# Altium schematic sheet STM32.SchDoc
size A3
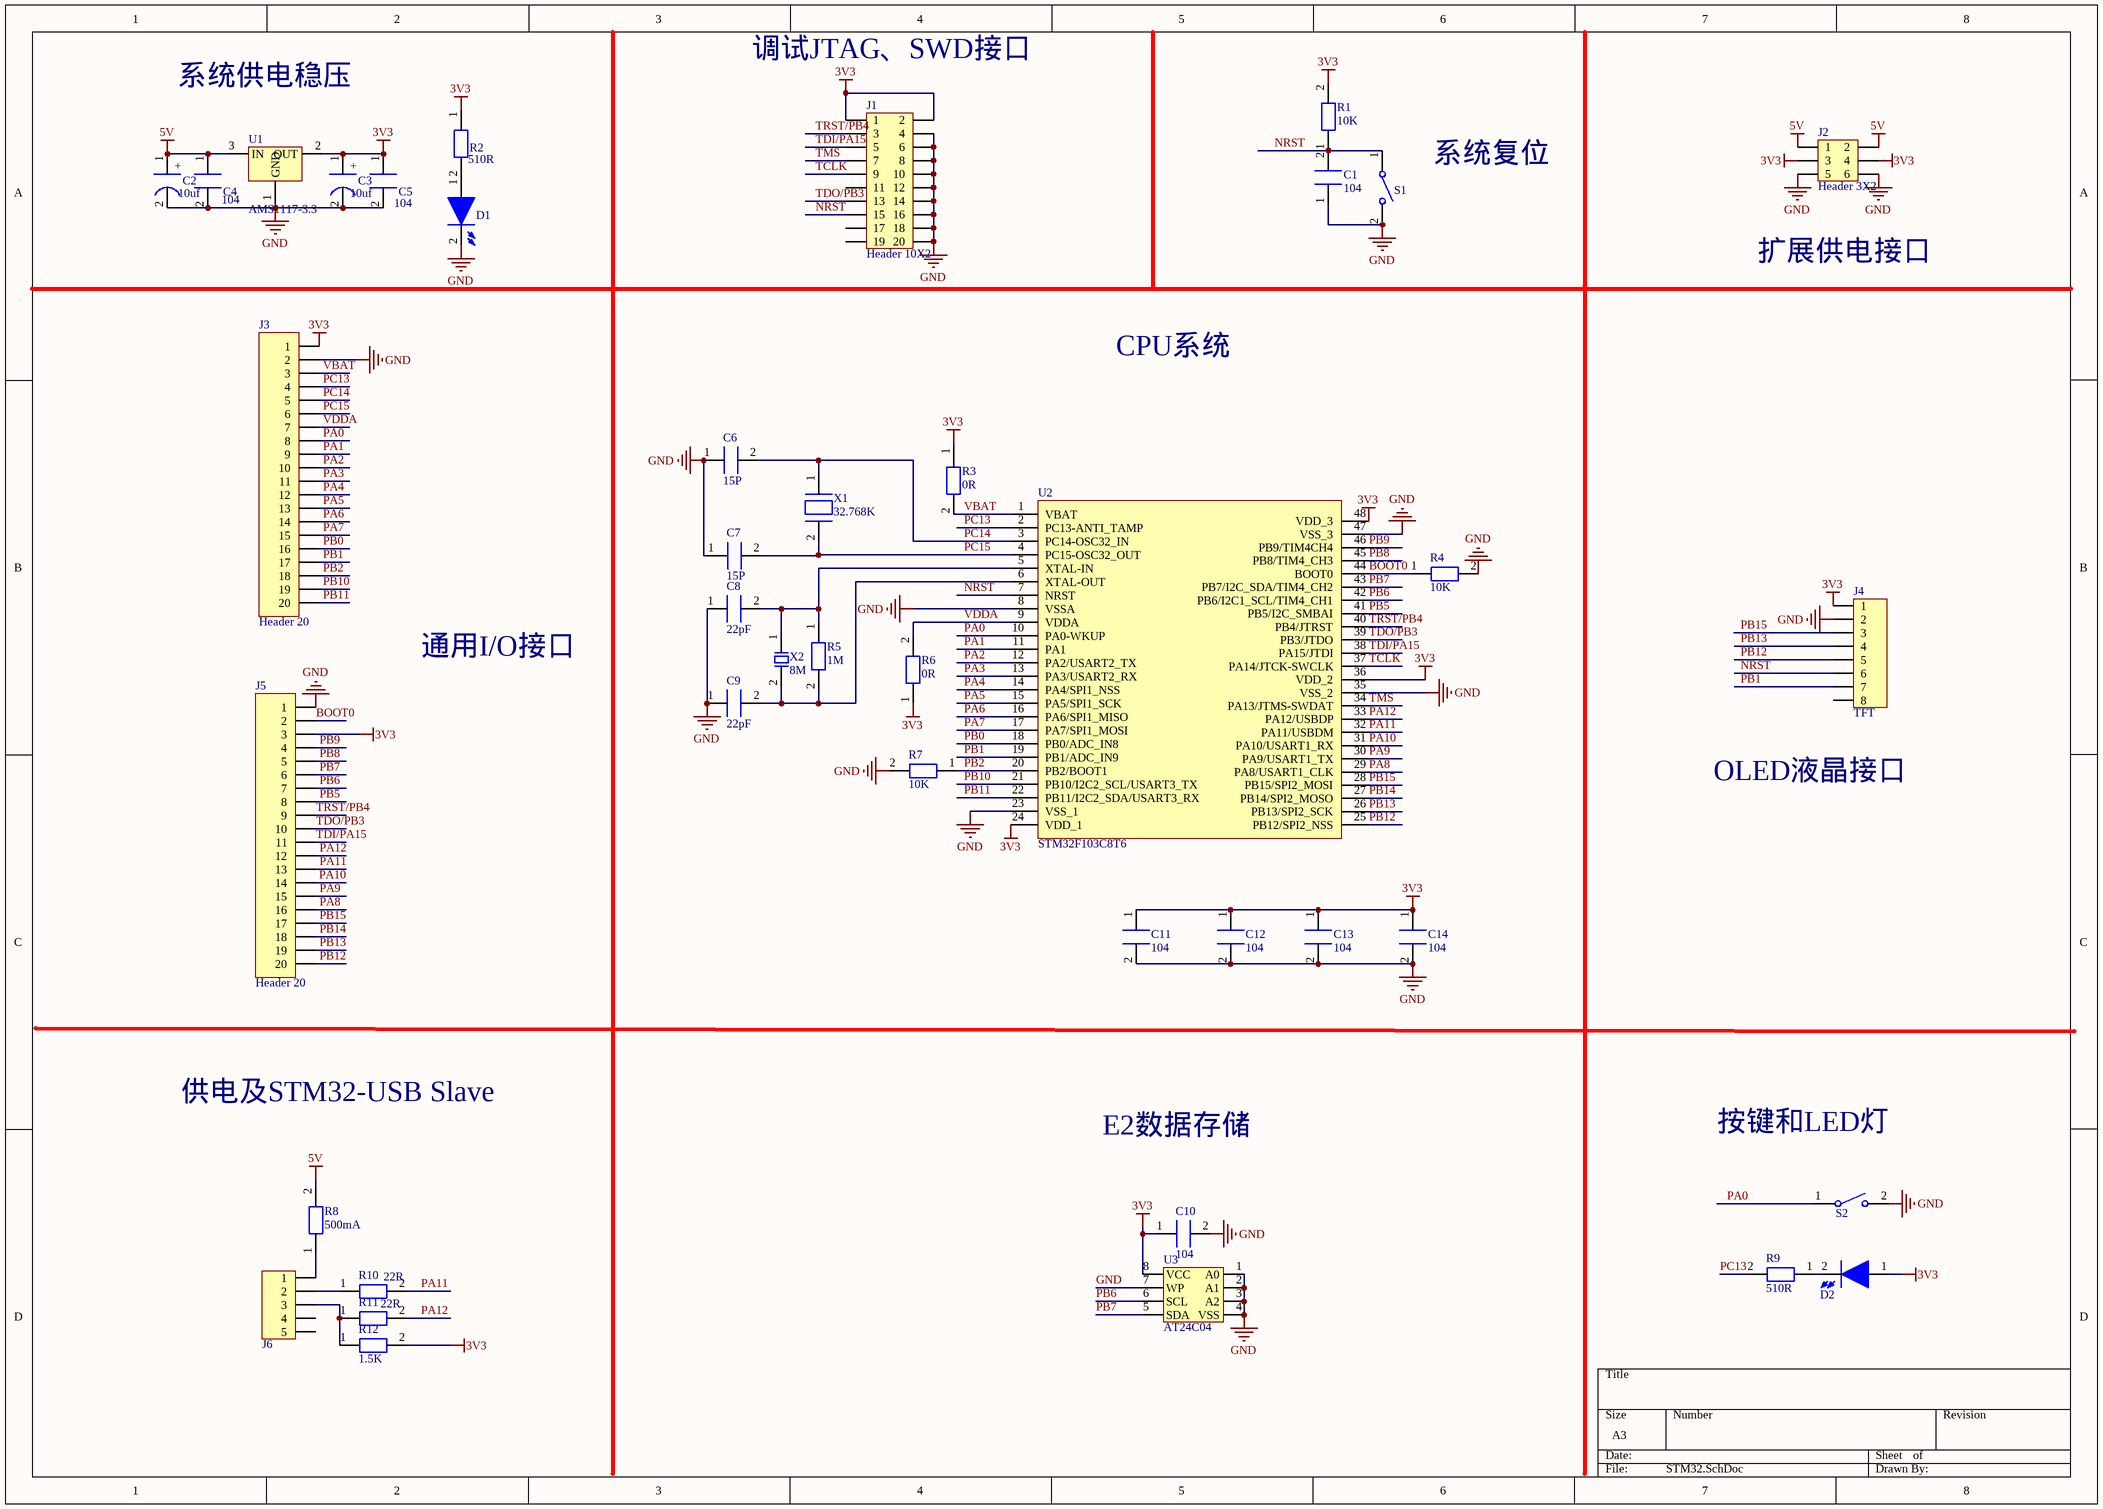
[diagram p0: STM32.SchDoc]

## Parts
C1  104  [RC0603]
C2  10uf  [0805]
C3  10uf  [0805]
C4  104  [RC0603]
C5  104  [RC0603]
C6  15P  [RC0603]
C7  15P  [RC0603]
C8  22pF  [RC0603]
C9  22pF  [RC0603]
C10  104  [RC0603]
C11  104  [RC0603]
C12  104  [RC0603]
C13  104  [RC0603]
C14  104  [RC0603]
D1  LED0  [LED0805]  (value not drawn)
D2  LED0  [LED0805]  (value not drawn)
J1  Header 10X2  [JTAG_20P]
J2  Header 3X2  [H-3X2]
J3  Header 20  [H 20]
J4  TFT  [H-8]
J5  Header 20  [H 20]
J6  Mini-USB  [mini_USB]  (value not drawn)
R1  10K  [RC0603]
R2  510R  [RC0603]
R3  0R  [RC0603]
R4  10K  [RC0603]
R5  1M  [RC0603]
R6  0R  [RC0603]
R7  10K  [RC0603]
R8  500mA  [0805]
R9  510R  [RC0603]
R10  22R  [RC0603]
R11  22R  [RC0603]
R12  1.5K  [RC0603]
S1  SW-SPST  [SMT-KEY]  (value not drawn)
S2  SW-SPST  [SMT-KEY]  (value not drawn)
U1  AMS1117-3.3  [SOT223]
U2  STM32F103C8T6  [LQFP48]
U3  AT24C04  [SOIC-8]
X1  32.768K  [JZ32768]
X2  8M  [JZ49S]

## Nets
3V3: C3.1 C5.1 C10.1 C11.1 C12.1 C13.1 C14.1 D2.1 J1.1 J1.2 J2.3 J2.4 J3.1 J4.1 J5.3 R1.2 R2.1 R3.1 R6.1 R12.2 U1.2(OUT) U2.24(VDD_1) U2.36(VDD_2) U2.48(VDD_3) U3.8(VCC)
5V: C2.1 C4.1 J2.1 J2.2 R8.2 U1.3(IN)
GND: C1.1 C2.2 C3.2 C4.2 C5.2 C6.1 C7.1 C8.1 C9.1 C10.2 C11.2 C12.2 C13.2 C14.2 D1.2 J1.4 J1.6 J1.8 J1.10 J1.12 J1.14 J1.16 J1.18 J1.20 J2.5 J2.6 J3.2 J4.2 J5.1 R4.2 R7.2 S1.2 S2.2 U1.1(GND) U2.8(VSSA) U2.23(VSS_1) U2.35(VSS_2) U2.47(VSS_3) U3.1(A0) U3.2(A1) U3.3(A2) U3.4(VSS) U3.7(WP)
BOOT0: J5.2 R4.1 U2.44(BOOT0)
NRST: C1.2 J1.15 J4.6 R1.1 S1.1 U2.7(NRST)
PA0: J3.8 S2.1 U2.10(PA0-WKUP)
PA1: J3.9 U2.11(PA1)
PA2: J3.10 U2.12(PA2/USART2_TX)
PA3: J3.11 U2.13(PA3/USART2_RX)
PA4: J3.12 U2.14(PA4/SPI1_NSS)
PA5: J3.13 U2.15(PA5/SPI1_SCK)
PA6: J3.14 U2.16(PA6/SPI1_MISO)
PA7: J3.15 U2.17(PA7/SPI1_MOSI)
PA8: J5.16 U2.29(PA8/USART1_CLK)
PA9: J5.15 U2.30(PA9/USART1_TX)
PA10: J5.14 U2.31(PA10/USART1_RX)
PA11: J5.13 R10.2 U2.32(PA11/USBDM)
PA12: J5.12 R11.2 U2.33(PA12/USBDP)
PB0: J3.16 U2.18(PB0/ADC_IN8)
PB1: J3.17 J4.7 U2.19(PB1/ADC_IN9)
PB2: J3.18 R7.1 U2.20(PB2/BOOT1)
PB5: J5.8 U2.41(PB5/I2C_SMBAI)
PB6: J5.7 U2.42(PB6/I2C1_SCL/TIM4_CH1) U3.6(SCL)
PB7: J5.6 U2.43(PB7/I2C_SDA/TIM4_CH2) U3.5(SDA)
PB8: J5.5 U2.45(PB8/TIM4_CH3)
PB9: J5.4 U2.46(PB9/TIM4CH4)
PB10: J3.19 U2.21(PB10/I2C2_SCL/USART3_TX)
PB11: J3.20 U2.22(PB11/I2C2_SDA/USART3_RX)
PB12: J4.5 J5.20 U2.25(PB12/SPI2_NSS)
PB13: J4.4 J5.19 U2.26(PB13/SPI2_SCK)
PB14: J5.18 U2.27(PB14/SPI2_MOSO)
PB15: J4.3 J5.17 U2.28(PB15/SPI2_MOSI)
PC13: J3.4 R9.2 U2.2(PC13-ANTI_TAMP)
PC14: C6.2 J3.5 U2.3(PC14-OSC32_IN) X1.1
PC15: C7.2 J3.6 U2.4(PC15-OSC32_OUT) X1.2
TCLK: J1.9 U2.37(PA14/JTCK-SWCLK)
TDI/PA15: J1.5 J5.11 U2.38(PA15/JTDI)
TDO/PB3: J1.13 J5.10 U2.39(PB3/JTDO)
TMS: J1.7 U2.34(PA13/JTMS-SWDAT)
TRST/PB4: J1.3 J5.9 U2.40(PB4/JTRST)
VBAT: J3.3 R3.2 U2.1(VBAT)
VDDA: J3.7 R6.2 U2.9(VDDA)
NetC8_2: C8.2 R5.1 U2.5(XTAL-IN) X2.1
NetC9_2: C9.2 R5.2 U2.6(XTAL-OUT) X2.2
NetD1_1: D1.1 R2.2
NetD2_2: D2.2 R9.1
NetJ6_1: J6.1 R8.1
NetJ6_2: J6.2 R10.1
NetJ6_3: J6.3 R11.1 R12.1

Not connected (* = marked no-connect by the designer): J1 11 17 19; J4 8; J6 4 5

## Notes on the sheet
- 系统供电稳压
- 调试JTAG、SWD接口
- (near S1) 系统复位
- 扩展供电接口
- CPU系统
- 通用I/O接口
- OLED液晶接口
- 供电及STM32-USB Slave
- E2数据存储
- 按键和LED灯
- (in symbol CAP+) +

## Library data of the parts
C1 C4-C14 = CAP: 电容
C2 C3 = CAP+: 极性电容
D1 D2 = LED0: LED
R1-R12 = RES: 电阻
S1 S2 = SW-SPST: 开关
U1 = AMS1117-3.3: IC
U2 = STM32F103C8T6: IC
U3 = AT24C04: IC